# EAGLE design t4_ega_vga (EAGLE 9.6.1)
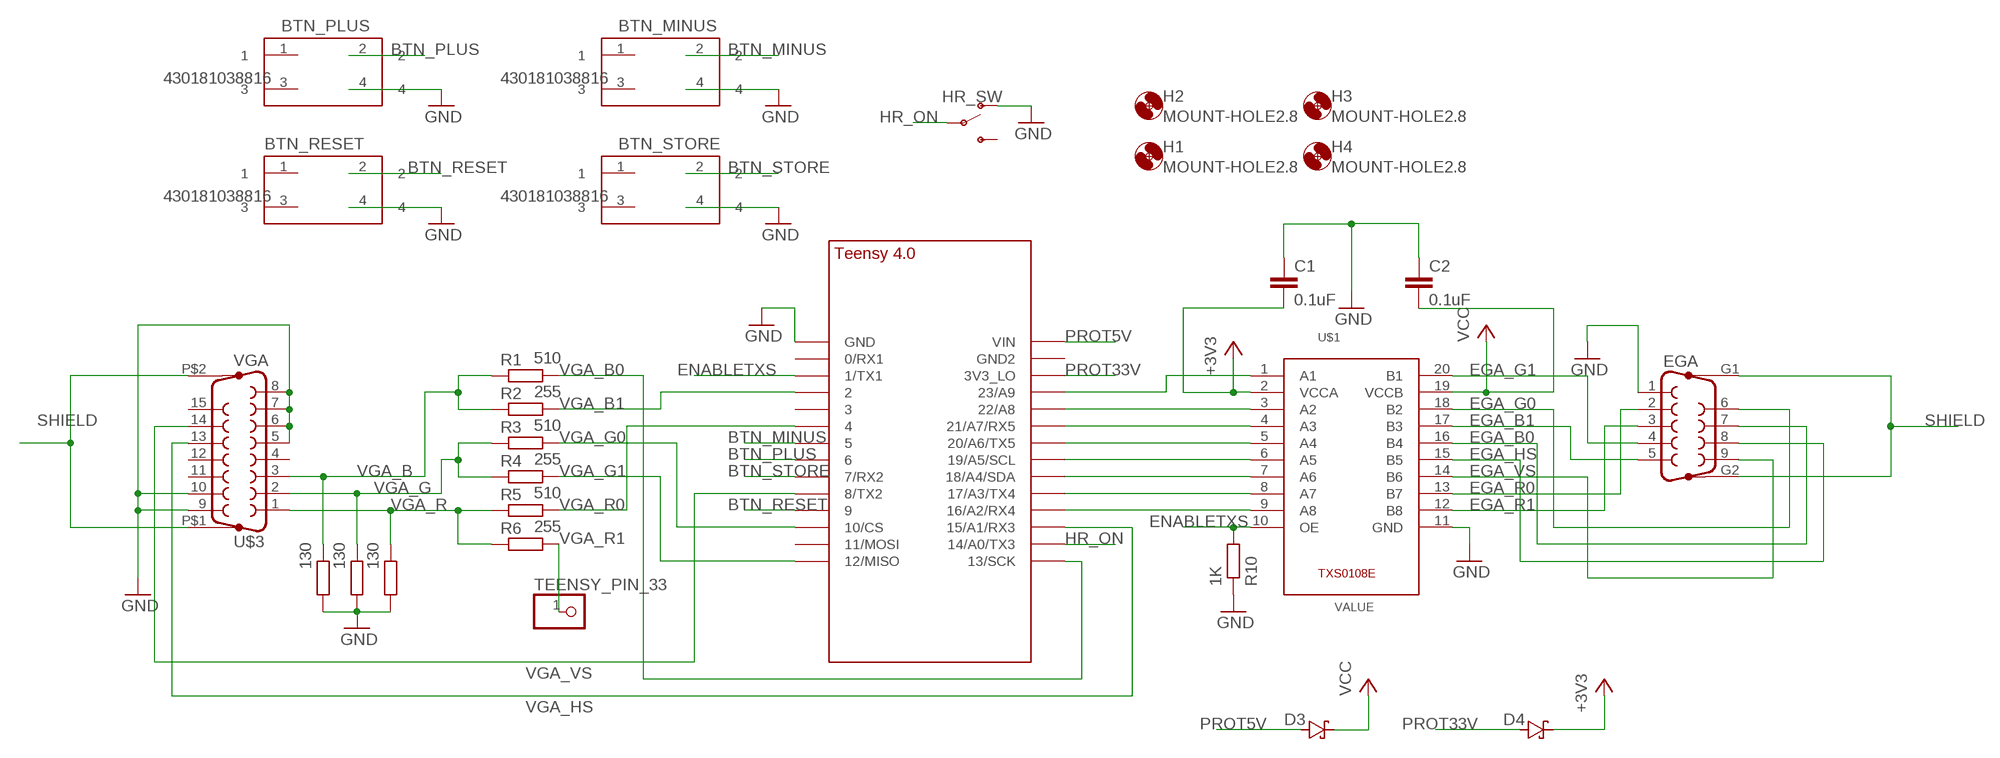
[diagram p0: schematic, sheet 1]

## Parts
BTN_MINUS  430181038816  [430181038816]
BTN_PLUS  430181038816  [430181038816]
BTN_RESET  430181038816  [430181038816]
BTN_STORE  430181038816  [430181038816]
C1  0.1uF  C-EUC0603  [C0603]
C2  0.1uF  C-EUC0603  [C0603]
D3  SMA-SS34-SYMBOL  [SMA-SS34]
D4  SMA-SS34-SYMBOL  [SMA-SS34]
EGA  F09HP  [F09HP]
H1  MOUNT-HOLE2.8  [2,8]
H2  MOUNT-HOLE2.8  [2,8]
H3  MOUNT-HOLE2.8  [2,8]
H4  MOUNT-HOLE2.8  [2,8]
HR_SW  SWITCH-SPDT-SMD-RIGHT-ANGLE  [SWITCH_SPST_SMD_A]
R1  510  R-EU_R0603  [R0603]
R2  255  R-EU_R0603  [R0603]
R3  510  R-EU_R0603  [R0603]
R4  255  R-EU_R0603  [R0603]
R5  510  R-EU_R0603  [R0603]
R6  255  R-EU_R0603  [R0603]
R7  130  R-EU_R0603  [R0603]
R8  130  R-EU_R0603  [R0603]
R9  130  R-EU_R0603  [R0603]
R10  1K  R-EU_R0603  [R0603]
TEENSY_PIN_33  PINHD-1X1  [1X01]
U2  TEENSY_4.0-BASIC  [TEENSY_4.0-BASIC]
U$1  TXS0108E  [TSSOP20]
U$3  VGA  [HDF15H]

## Nets
+3V3: C1.2 D4.2(K) U$1.2(VCCA)
BTN_MINUS: BTN_MINUS.2 U2.5
BTN_PLUS: BTN_PLUS.2 U2.6
BTN_RESET: BTN_RESET.2 U2.9/CS
BTN_STORE: BTN_STORE.2 U2.7(7/RX2)
EGA_B0: EGA.7 U$1.16(B4)
EGA_B1: EGA.5 U$1.17(B3)
EGA_G0: EGA.6 U$1.18(B2)
EGA_G1: EGA.4 U$1.20(B1)
EGA_HS: EGA.8 U$1.15(B5)
EGA_R0: EGA.2 U$1.13(B7)
EGA_R1: EGA.3 U$1.12(B8)
EGA_VS: EGA.9 U$1.14(B6)
ENABLETXS: R10.2 U2.1/TX(1/TX1) U$1.10(OE)
GND: BTN_MINUS.4 BTN_PLUS.4 BTN_RESET.4 BTN_STORE.4 C1.1 C2.1 EGA.1 HR_SW.1(O) R7.1 R8.1 R9.1 R10.1 U2.GND U$1.11(GND) U$3.5 U$3.6 U$3.7 U$3.8 U$3.9 U$3.10
HR_ON: HR_SW.2(P) U2.14/A0(14/A0/TX3)
N$1: U2.23/A9 U$1.1(A1)
N$2: U2.22/A8 U$1.3(A2)
N$3: U2.21/A7(21/A7/RX5) U$1.4(A3)
N$4: U2.20/A6(20/A6/TX5) U$1.5(A4)
N$5: U2.19/A5/SCL U$1.6(A5)
N$6: U2.18/A4/SDA U$1.7(A6)
N$7: U2.17/A3(17/A3/TX4) U$1.8(A7)
N$8: U2.16/A2(16/A2/RX4) U$1.9(A8)
PROT5V: D3.1(A) U2.VIN
PROT33V: D4.1(A) U2.3V3_LO
SHIELD: EGA.G1 EGA.G2 U$3.P$1(G1) U$3.P$2(G2)
VCC: C2.2 D3.2(K) U$1.19(VCCB)
VGA_B: R1.1 R2.1 R7.2 U$3.3
VGA_B0: R1.2 U2.13/SCK
VGA_B1: R2.2 U2.2
VGA_G: R3.1 R4.1 R8.2 U$3.2
VGA_G0: R3.2 U2.10/CS
VGA_G1: R4.2 U2.12/MISO
VGA_HS: U2.15/A1(15/A1/RX3) U$3.13
VGA_R: R5.1 R6.1 R9.2 U$3.1
VGA_R0: R5.2 U2.4/CANRX
VGA_R1: R6.2 TEENSY_PIN_33.1
VGA_VS: U2.8(8/TX2) U$3.14
Unconnected: BTN_MINUS.1 BTN_MINUS.3 BTN_PLUS.1 BTN_PLUS.3 BTN_RESET.1 BTN_RESET.3 BTN_STORE.1 BTN_STORE.3 HR_SW.3(S) U2.0/RX(0/RX1) U2.3/CANTX U2.11/MOSI U2.GND2 U$3.4 U$3.11 U$3.12 U$3.15

## Library data of the parts
BTN_MINUS BTN_PLUS BTN_RESET BTN_STORE = Wurth_Elektronik_Electromechanic_Switchs_rev15b:430181038816: WS-TSS-4.5x4.5 mm SMD Tact Switch,4 pins
C1 C2 = rcl:C-EU: CAPACITOR, European symbol; SPICEPREFIX: C
D3 D4 = SMA-SS34:SMA-SS34-SYMBOL
EGA = con-subd:F09HP: SUB-D; OC_FARNELL: unknown; OC_NEWARK: unknown
H1-H4 = holes:MOUNT-HOLE: MOUNTING HOLE with drill center marker
HR_SW = SparkFun-Switches:SWITCH-SPDT: Single Pole, Double Throw (SPDT) Switch Single-pole, double-throw (SPDT) switch. Variant Overview SMD-AYZ0202 Surface Mount DPDT Switch <https://www.sparkfun.com/products/597> (COM-00597) Used on e.g. LilyPad Arduino USB - ATmega32U4 Board <https://www.sparkfun.com/products/12049> PTH-11.6X4.0MM SPDT Mini Power Switch <https://www.sparkfun.com/products/102> (COM-00102) Used on e.g. SparkFun Simon Says - Through-Hole Soldering Kit <https://www.sparkfun.com/products/10547> (KIT-10547) PTH-11.6X4.0MM-KIT KIT version of SPDT Mini Power Switch - Simplifies soldering by removing tStop of switch pins - only one side can be soldered. PTH-11.6X4.0MM-LOCK LOCK version of SPDT Mini Power Switch - Offset pins hold switch in place for easier soldering. SMD-RIGHT-ANGLE Surface Mount Right Angle Switch <https://www.sparkfun.com/products/10860> (COM-10860) Used on e.g. SparkFun ESP8266 Thing <https://www.sparkfun.com/products/13231>; PROD_ID: SWCH-10651; SF_SKU: COM-10860
R1-R10 = rcl:R-EU_: RESISTOR, European symbol; SPICEPREFIX: R
TEENSY_PIN_33 = pinhead:PINHD-1X1: PIN HEADER
U2 = Teensy-4.0:TEENSY_4.0-BASIC
U$1 = Teensy-4.0:TXS0108E
U$3 = con-subd:VGA

## Board
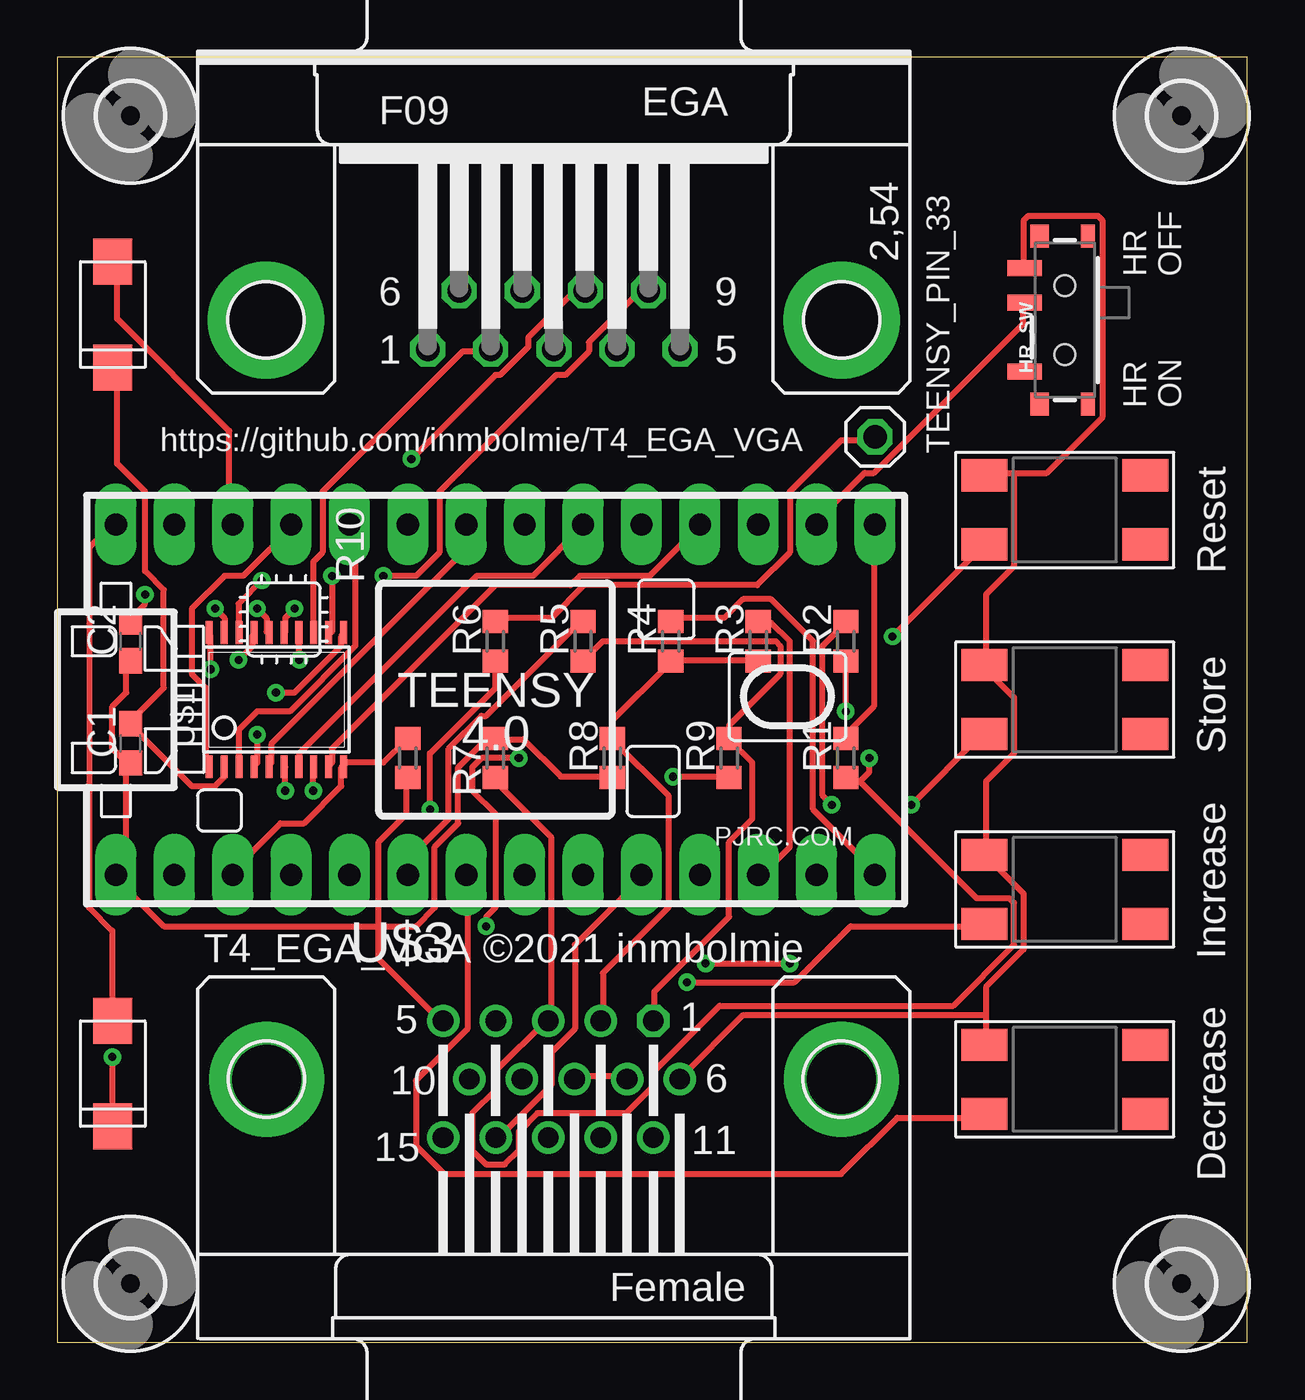
[diagram p1: board, top side]
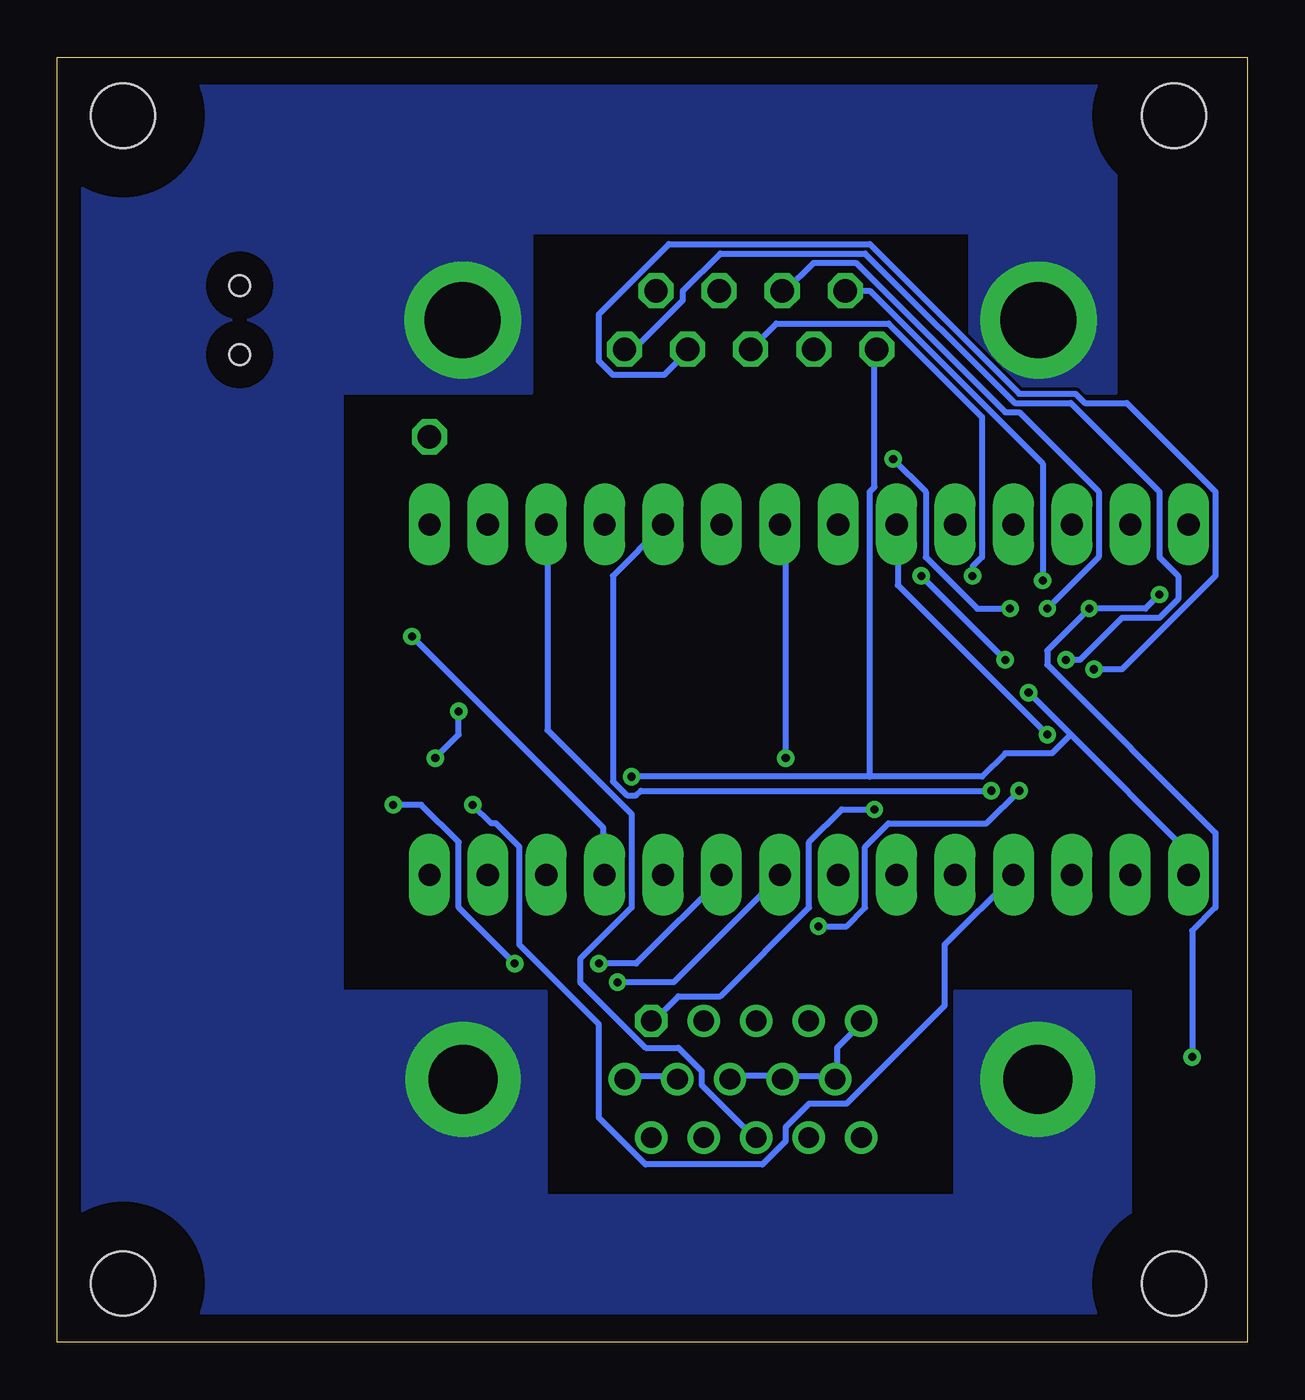
[diagram p2: board, bottom side, seen from below]

Size 51.74 x 55.87 mm. Coordinates in mm from the lower left corner, seen from the top.
Outline: 0,0 51.74,0 51.74,55.87 0,55.87 0,0
Copper layers (1*16): Top 0.035mm / dielectric 1.5mm / Bottom 0.035mm
Design rules "default *": minimum track width 10mil, minimum drill 0.35mm, track to track 6mil, track to pad 6mil, pad to pad 6mil, via to via 6mil, smd to smd 6mil, copper to edge 40mil, drill to drill 6mil, minimum pad ring 10mil, minimum via ring 8mil, stop-mask expansion 4mil, vias tented up to drill 0mil, thermal gap 10mil

### Footprints (pad centres in the part's own frame; a part is rotated, then mirrored left to right if it is on the bottom)
430181038816 = smd 2 x 1.4: 1 -3.5,1.5; 2 3.5,1.5; 3 -3.5,-1.5; 4 3.5,-1.5
C0603 = smd 1.1 x 1: 1 -0.85,0; 2 0.85,0
SMA-SS34 = smd 2 x 1.7: 1 0,-1.4; 2 4.6,-1.4
F09HP = drill 1.016 octagon: 1 -5.486,-1.27; 2 -2.743,-1.27; 3 0,-1.27; 4 2.743,-1.27; 5 5.486,-1.27; 6 -4.115,1.27; 7 -1.372,1.27; 8 1.372,1.27; 9 4.115,1.27 | drill 3.302 pad 5.08: G1 -12.522,0; G2 12.522,0
2,8 = hole 2.8: 0,0
SWITCH_SPST_SMD_A = smd 0.7 x 1.5: 1 -2.25,-1.75; 2 -0.75,-1.75; 3 2.25,-1.75 | smd 1 x 0.6: GND1 -3.65,1; GND3 3.65,1 | smd 1 x 0.8: GND2 -3.65,-1.1; GND4 3.65,-1.1 | hole 0.9: -1.5,0; 1.5,0
R0603 = smd 1 x 1.1: 1 -0.85,0; 2 0.85,0
1X01 = drill 1.016 octagon: 1 0,0
TEENSY_4.0-BASIC = drill 0.965 pad 1.778 long: 0/RX -13.97,-7.62; 1/TX -11.43,-7.62; 2 -8.89,-7.62; 3/CANTX -6.35,-7.62; 3V3_LO -11.43,7.62; 4/CANRX -3.81,-7.62; 5 -1.27,-7.62; 6 1.27,-7.62; 7 3.81,-7.62; 8 6.35,-7.62; 9/CS 8.89,-7.62; 10/CS 11.43,-7.62; 11/MOSI 13.97,-7.62; 12/MISO 16.51,-7.62; 13/SCK 16.51,7.62; 14/A0 13.97,7.62; 15/A1 11.43,7.62; 16/A2 8.89,7.62; 17/A3 6.35,7.62; 18/A4/SDA 3.81,7.62; 19/A5/SCL 1.27,7.62; 20/A6 -1.27,7.62; 21/A7 -3.81,7.62; 22/A8 -6.35,7.62; 23/A9 -8.89,7.62; GND -16.51,-7.62; GND2 -13.97,7.62; VIN -16.51,7.62
TSSOP20 = smd 0.305 x 0.991: 1 -2.925,-2.918; 2 -2.275,-2.918; 3 -1.625,-2.918; 4 -0.975,-2.918; 5 -0.325,-2.918; 6 0.325,-2.918; 7 0.975,-2.918; 8 1.625,-2.918; 9 2.275,-2.918; 10 2.925,-2.918; 11 2.925,2.918; 12 2.275,2.918; 13 1.625,2.918; 14 0.975,2.918; 15 0.325,2.918; 16 -0.325,2.918; 17 -0.975,2.918; 18 -1.625,2.918; 19 -2.275,2.918; 20 -2.925,2.918
HDF15H = drill 0.9 octagon: 1 4.329,2.54 | drill 0.9: 2 2.043,2.54; 3 -0.243,2.54; 4 -2.529,2.54; 5 -4.815,2.54; 6 5.472,0; 7 3.186,0; 8 0.9,0; 9 -1.386,0; 10 -3.672,0; 11 4.329,-2.54; 12 2.043,-2.54; 13 -0.243,-2.54; 14 -2.529,-2.54; 15 -4.815,-2.54 | drill 3 pad 5: P$1 -12.5,0; P$2 12.5,0

### Placement (x,y rotation side)
BTN_MINUS  43.81,11.43 180 top
BTN_PLUS  43.81,19.68 180 top
BTN_RESET  43.81,36.2 180 top
BTN_STORE  43.81,27.94 180 top
C1  3.18,26.04 90 top
C2  3.18,30.48 90 top
D3  3.81,13.97 270 top
D4  3.81,46.99 270 top
EGA  21.59,44.45 0 top
H1  48.89,2.54 0 top
H2  3.18,2.54 0 top
H3  48.89,53.34 0 top
H4  3.18,53.34 0 top
HR_SW  43.81,44.45 270 top
R1  34.29,25.4 90 top
R2  34.29,30.48 90 top
R3  30.48,30.48 90 top
R4  26.67,30.48 90 top
R5  22.86,30.48 90 top
R6  19.05,30.48 90 top
R7  19.05,25.4 270 top
R8  24.13,25.4 90 top
R9  29.21,25.4 90 top
R10  15.24,25.4 90 top
TEENSY_PIN_33  35.56,39.37 0 top
U2  19.05,27.94 0 top
U$1  9.52,27.94 0 top
U$3  21.59,11.43 0 top

### Tracks (layer width: path | path; a pad name or v marks a point on that pad's centre or on a via)
+3V3
  Top 0.254: U$1.2 7.26,24.99 7.26,24.59 6.86,24.18 5.84,24.18 3.2,26.82 C1.2 3.2,27.03 4.62,28.45 4.62,32.72 3.81,33.53 3.81,36.98 2.59,38.2 2.59,42.27 D4.2
BTN_MINUS
  Top 0.254: BTN_MINUS.2 40.18,9.75 36.53,9.75 34.09,7.32 16.82,7.32 15.6,8.53 15.6,11.38 17.83,13.61 17.83,20.32 U2.5
BTN_PLUS  (via drill 0.35)
  Top 0.254: v27.38,15.65 32.06,15.65 34.49,18.09 40.18,18.09 BTN_PLUS.2
  Bottom 0.254: v27.38,15.65 24.94,15.65 20.27,20.32 U2.6
BTN_RESET  (via drill 0.35)
  Top 0.254: v36.32,30.68 40.18,34.54 BTN_RESET.2
  Bottom 0.254: v36.32,30.68 27.99,22.35 27.99,20.32 U2.9/CS
BTN_STORE  (via drill 0.35)
  Top 0.254: v37.14,23.37 40.18,26.42 BTN_STORE.2 | v28.19,16.46 v31.85,16.46
  Bottom 0.254: v37.14,23.37 35.92,23.37 34.29,21.74 34.29,18.9 v31.85,16.46 | v28.19,16.46 26.57,16.46 22.71,20.32 U2.7
EGA_B0  (via drill 0.35)
  Top 0.254: v8.69,31.9 9.09,31.5 9.09,30.89 U$1.16
  Bottom 0.254: v8.69,31.9 6.45,34.14 6.45,36.98 9.91,40.44 10.52,40.44 17.02,46.94 18.85,46.94 20.07,45.72 EGA.7
EGA_B1  (via drill 0.35)
  Top 0.254: v7.87,29.67 8.48,30.28 8.48,30.68 U$1.17
  Bottom 0.254: v7.87,29.67 7.26,29.67 5.44,31.5 3.81,31.5 3,32.31 3,33.33 3.81,34.14 3.81,36.98 7.67,40.84 10.11,40.84 16.61,47.35 22.91,47.35 24.54,45.72 24.54,45.31 26.57,43.28 26.97,43.28 EGA.5
EGA_G0  (via drill 0.35)
  Top 0.254: v8.89,33.12 7.87,32.11 7.87,30.89 U$1.18
  Bottom 0.254: v8.89,33.12 8.89,38.2 16.41,45.72 EGA.6
EGA_G1  (via drill 0.35)
  Top 0.254: v6.66,29.26 6.66,30.68 U$1.20
  Bottom 0.254: v6.66,29.26 5.44,29.26 1.37,33.33 1.37,36.98 5.23,40.84 7.06,40.84 7.47,41.25 9.91,41.25 16.41,47.75 25.15,47.75 28.19,44.7 28.19,42.67 27.58,42.06 25.35,42.06 24.33,43.08 EGA.4
EGA_HS  (via drill 0.35)
  Top 0.254: v10.31,31.9 9.91,31.5 9.91,30.89 U$1.15 | v15.39,38.41 19.05,42.06 19.25,42.06 20.47,43.28 20.47,43.69 22.5,45.72 EGA.8
  Bottom 0.254: v10.31,31.9 11.74,31.9 13.97,34.14 13.97,36.98 v15.39,38.41
EGA_R0
  Top 0.254: U$1.13 11.13,30.89 11.13,33.93 11.53,34.34 11.53,36.98 17.63,43.08 18.85,43.08 EGA.2
EGA_R1  (via drill 0.35)
  Top 0.254: v11.94,33.33 11.94,30.89 U$1.12
  Bottom 0.254: v11.94,33.33 11.94,33.73 11.53,34.14 11.53,40.23 15.6,44.3 20.47,44.3 EGA.3
EGA_VS  (via drill 0.35)
  Top 0.254: v10.52,29.67 10.52,30.68 U$1.14 | v14.17,33.33 15.6,33.33 16.61,34.34 16.61,36.98 21.69,42.06 22.1,42.06 23.11,43.08 23.11,43.48 25.35,45.72 EGA.9
  Bottom 0.254: v14.17,33.33 v10.52,29.67
ENABLETXS
  Top 0.254: R10.2 15.19,26.21 14.17,25.2 12.55,25.2 U$1.10 12.34,24.99 12.34,24.18 10.72,22.55 9.7,22.55 7.47,20.32 U2.1/TX
GND  (via drill 0.35)
  Top 0.254: 40.39,14.22 40.39,15.44 42.01,17.07 42.01,19.51 40.39,21.13 BTN_PLUS.4 40.39,21.34 40.39,24.38 41.61,25.6 41.61,28.04 40.39,29.26 BTN_STORE.4 40.39,29.46 40.39,32.51 41.61,33.73 41.61,37.8 | 40.39,14.22 40.39,13.01 BTN_MINUS.4 | 41.61,37.8 40.39,37.8 BTN_RESET.4 | 41.61,37.8 43.03,37.8 45.47,40.23 45.47,48.77 45.26,48.97 42.22,48.97 42.01,48.77 42.01,46.74 HR_SW.1 | U$3.7 24.74,11.58 22.5,11.58 U$3.8 | 19.05,26.21 20.27,26.21 21.89,24.59 24.13,24.59 R8.1 | 13.97,18.09 13.97,16.66 16.61,14.02 U$3.5 | 13.97,18.09 13.97,21.74 15.19,22.96 15.19,24.38 R10.1 | 19.05,26.21 18.64,26.21 17.42,24.99 17.42,22.55 16.41,21.54 16.41,18.9 15.6,18.09 13.97,18.09 | 19.05,26.21 R7.1 | v9.5,28.25 10.31,28.25 12.34,30.28 12.34,30.68 U$1.11 | C2.1 3,29.46 3,28.25 2.39,27.64 2.39,25.81 3,25.2 C1.1 3,24.99 3,20.73 2.59,20.32 U2.GND 2.39,20.32 4.62,18.09 13.97,18.09 | v26.77,24.59 29.21,24.59 R9.1 | 40.39,14.22 29.82,14.22 27.18,11.58 U$3.6
  Bottom 0.254: U$3.7 24.94,11.58 26.97,11.58 U$3.6 | U$3.8 22.3,11.58 20.27,11.58 U$3.9 20.07,11.58 18.03,11.58 U$3.10 17.83,11.58 17.83,12.8 16.82,13.82 U$3.5 | 7.67,26.42 2.59,21.34 2.59,20.32 U2.GND | 7.67,26.42 v9.5,28.25 | 16.41,24.59 11.53,24.59 10.52,25.6 8.48,25.6 7.67,26.42 | 16.41,24.59 v26.77,24.59 | 16.41,24.59 16.41,36.98 16.21,37.19 16.21,43.08 EGA.1
HR_ON
  Top 0.254: HR_SW.2 42.01,45.11 42.01,44.3 35.51,37.8 35.1,37.8 32.87,35.56 U2.14/A0
N$1
  Top 0.254: U$1.1 6.45,25.2 6.45,28.45 5.84,29.06 5.84,31.9 7.26,33.33 8.08,33.33 10.31,35.56 U2.23/A9
N$2
  Top 0.254: U$1.3 7.87,25.2 7.87,26.62 8.69,27.43 10.11,27.43 12.95,30.28 12.95,35.36 12.75,35.56 U2.22/A8
N$3  (via drill 0.35)
  Top 0.254: v8.69,26.42 8.69,25.2 U$1.4
  Bottom 0.254: v8.69,26.42 15.19,32.92 15.19,35.56 U2.21/A7
N$4
  Top 0.254: U$1.5 9.3,25.2 9.3,26.01 17.63,34.34 17.63,35.56 U2.20/A6
N$5  (via drill 0.35)
  Top 0.254: v9.91,23.98 9.91,24.99 U$1.6 | v18.64,18.09 18.64,18.49 19.05,18.9 19.05,22.96 18.03,23.98 18.03,24.99 18.44,25.4 v20.07,25.4
  Bottom 0.254: v9.91,23.98 11.33,22.55 15.6,22.55 16.61,21.54 16.61,18.9 17.42,18.09 v18.64,18.09 | v20.07,25.4 20.07,35.36 20.27,35.56 U2.19/A5/SCL
N$6
  Top 0.254: U$1.7 10.52,25.2 10.52,25.6 18.24,33.33 20.68,33.33 22.91,35.56 U2.18/A4/SDA
N$7  (via drill 0.35)
  Top 0.254: v11.13,23.98 11.13,24.99 U$1.8
  Bottom 0.254: v11.13,23.98 26.36,23.98 26.57,23.77 26.97,23.77 27.58,24.38 27.58,33.33 25.35,35.56 U2.17/A3
N$8
  Top 0.254: U$1.9 11.94,25.2 11.94,25.81 19.05,32.92 22.3,32.92 22.71,33.33 25.76,33.33 27.99,35.56 U2.16/A2
PROT5V
  Top 0.254: D3.1 2.39,14.02 2.39,17.88 1.37,18.9 1.37,34.54 2.39,35.56 U2.VIN
PROT33V
  Top 0.254: D4.1 2.59,46.94 2.59,44.5 7.47,39.62 7.47,35.56 U2.3V3_LO
SHIELD
  pour Bottom (no thermals): 5.71,54.61 5.71,41.27 12.07,41.27 12.07,48.26 31.11,48.26 31.11,41.27 39.37,41.27 39.37,15.24 30.48,15.24 30.48,6.35 12.7,6.35 12.7,15.24 5.08,15.24 5.08,1.27 50.8,1.27 50.8,54.61
VCC  (via drill 0.35)
  Top 0.254: v6.86,31.9 7.26,31.5 7.26,30.89 U$1.19 | v3.81,32.51 3.81,32.11 3.2,31.5 C2.2 | v2.39,12.39 2.39,9.55 D3.2
  Bottom 0.254: v3.81,32.51 4.42,31.9 v6.86,31.9 8.69,30.07 8.69,29.46 1.37,22.15 1.37,18.9 2.39,17.88 v2.39,12.39
VGA_B  (via drill 0.35)
  Top 0.254: R7.2 19.05,24.38 21.49,21.95 21.49,14.02 U$3.3 21.29,14.02 19.05,11.79 19.05,10.97 18.03,9.96 18.03,8.33 18.64,7.72 19.46,7.72 20.07,8.33 20.07,9.14 20.88,9.96 24.74,9.96 25.96,11.18 25.96,11.79 28.8,14.63 38.96,14.63 41.61,17.27 41.61,19.1 41.4,19.3 39.98,19.3 34.9,24.38 | 34.9,24.38 34.29,24.38 R1.1 | v34.29,27.43 R2.1 | v35.31,25.4 35.31,24.79 34.9,24.38
  Bottom 0.254: v34.29,27.43 34.29,26.42 v35.31,25.4
VGA_B0
  Top 0.254: R1.2 34.29,26.42 35.51,27.64 35.51,35.56 U2.13/SCK
VGA_B1  (via drill 0.35)
  Top 0.254: v33.68,23.37 33.27,23.77 33.27,30.28 34.29,31.29 R2.2
  Bottom 0.254: v33.68,23.37 32.87,22.55 32.66,22.55 31.65,21.54 31.65,17.27 28.19,13.82 28.19,9.75 26.16,7.72 21.08,7.72 20.07,8.74 20.07,9.35 19.05,10.36 17.42,10.36 13.16,14.63 13.16,17.27 10.11,20.32 U2.2
VGA_G
  Top 0.254: R3.1 30.43,29.67 26.77,29.67 R4.1 26.57,29.46 24.13,27.03 R8.2 24.13,26.21 26.57,23.77 26.57,18.9 23.72,16.05 23.72,14.02 U$3.2
VGA_G0
  Top 0.254: R3.2 30.63,31.29 31.04,31.29 31.85,30.48 31.85,21.54 30.63,20.32 U2.10/CS
VGA_G1
  Top 0.254: R4.2 26.77,31.5 29.01,31.5 29.82,32.31 31.04,32.31 32.87,30.48 32.87,23.16 35.71,20.32 U2.12/MISO
VGA_HS
  Bottom 0.254: U$3.13 21.49,8.94 23.72,11.18 23.72,11.79 24.74,12.8 26.16,12.8 29.01,15.65 29.01,16.66 26.77,18.9 26.77,22.96 30.43,26.62 30.43,35.56 U2.15/A1
VGA_R  (via drill 0.35)
  Top 0.254: R5.1 22.91,29.67 23.72,30.48 31.24,30.48 31.44,30.28 31.44,29.06 29.21,26.82 R9.2 29.21,26.21 30.23,25.2 30.23,22.76 29.21,21.74 29.21,18.49 25.96,15.24 25.96,14.02 U$3.1 | R6.1 19.05,28.45 16.21,25.6 v16.21,23.16
  Bottom 0.254: v16.21,23.16 17.63,23.16 19.05,21.74 19.05,18.9 22.91,15.04 24.74,15.04 25.76,14.02 U$3.1
VGA_R0
  Top 0.254: R5.2 22.71,31.29 18.64,27.23 18.44,27.23 17.02,25.81 17.02,22.76 15.39,21.13 15.39,20.32 U2.4/CANRX
VGA_R1
  Top 0.254: R6.2 19.05,31.5 21.49,31.5 22.91,32.92 30.43,32.92 31.85,34.34 31.85,36.98 34.09,39.22 35.51,39.22 TEENSY_PIN_33.1
VGA_VS
  Top 0.254: U$3.14 19.25,8.94 21.49,11.18 21.49,12.6 22.5,13.61 22.5,17.27 25.55,20.32 U2.8

### Text on the board
tNames: HR / OFF | HR / ON | https://github.com/inmbolmie/T4_EGA_VGA | Reset | Store | Increase | T4_EGA_VGA ©2021 inmbolmie | Decrease